# EAGLE schematic untitled (EAGLE 8.6.0)
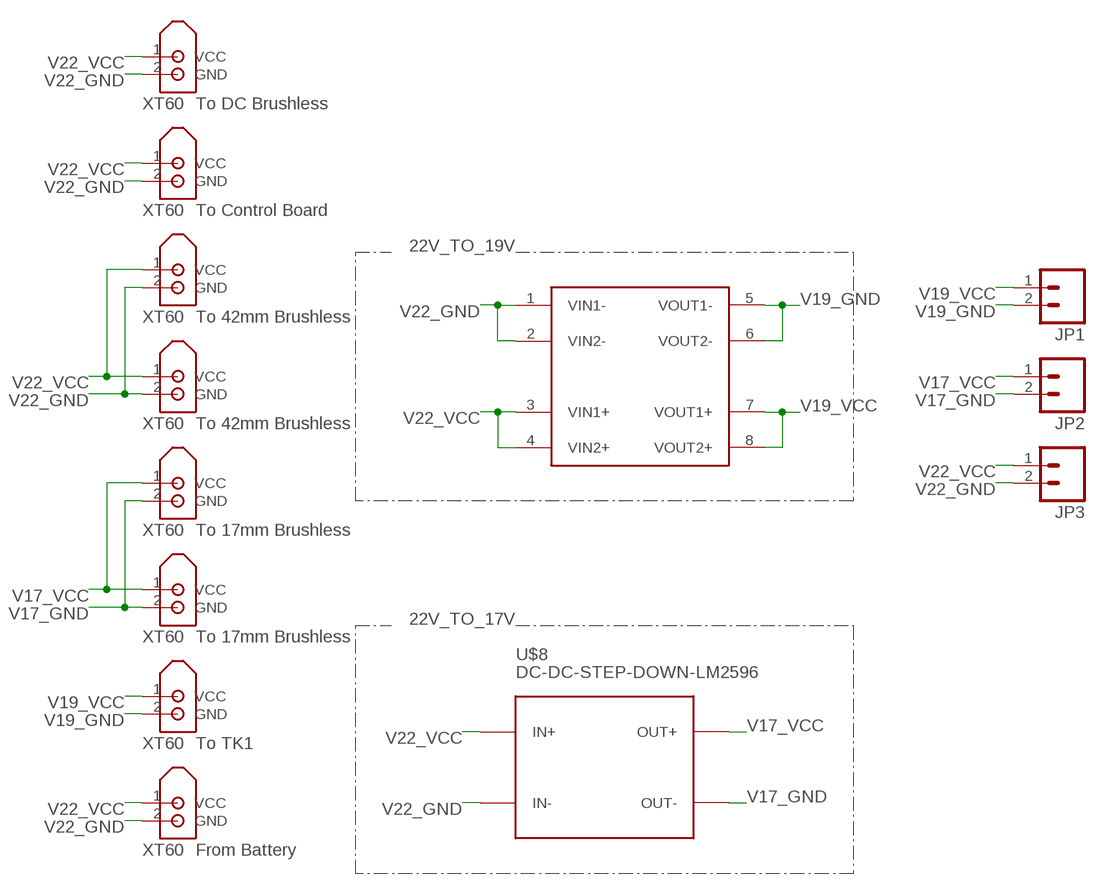
[diagram p0: schematic, sheet 1]

## Parts
JP1  M02JST-PTH-VERT  [JST-2-PTH-VERT]
JP2  M02JST-PTH-VERT  [JST-2-PTH-VERT]
JP3  M02JST-PTH-VERT  [JST-2-PTH-VERT]
U$1  XT60  [XT60]
U$2  XT60  [XT60]
U$3  XT60  [XT60]
U$4  XT60  [XT60]
U$5  XT60  [XT60]
U$6  XT60  [XT60]
U$7  MP1584  [MP1584_AMAZON]
U$8  DC-DC-STEP-DOWN-LM2596  [DC-DC-STEP-DOWN-LM2596]
U$9  XT60  [XT60]
U$10  XT60  [XT60]

## Nets
V17_GND [Voltmeter]: JP2.2 U$3.2(GND) U$4.2(GND) U$8.OUT-
V17_VCC [Voltmeter]: JP2.1 U$3.1(VCC) U$4.1(VCC) U$8.OUT+
V19_GND [Voltmeter]: JP1.2 U$2.2(GND) U$7.5(VOUT1-) U$7.6(VOUT2-)
V19_VCC [Voltmeter]: JP1.1 U$2.1(VCC) U$7.7(VOUT1+) U$7.8(VOUT2+)
V22_GND [Voltmeter]: JP3.2 U$1.2(GND) U$5.2(GND) U$6.2(GND) U$7.1(VIN1-) U$7.2(VIN2-) U$8.IN- U$9.2(GND) U$10.2(GND)
V22_VCC [Voltmeter]: JP3.1 U$1.1(VCC) U$5.1(VCC) U$6.1(VCC) U$7.3(VIN1+) U$7.4(VIN2+) U$8.IN+ U$9.1(VCC) U$10.1(VCC)

## Notes on the sheet
- To DC Brushless
- To Control Board
- 22V_TO_19V
- To 42mm Brushless
- To 42mm Brushless
- To 17mm Brushless
- 22V_TO_17V
- To 17mm Brushless
- To TK1
- From Battery

## Library data of the parts
JP1-JP3 = SparkFun-Connectors:M02: Standard 2-pin 0.1" header. Use with - straight break away headers ( PRT-00116) - right angle break away headers (PRT-00553) - swiss pins (PRT-00743) - machine pins (PRT-00117) - female headers (PRT-00115) Molex polarized connector foot print use with: PRT-08233 with associated crimp pins and housings. 2.54_SCREWTERM for use with PRT-10571. 3.5mm Screw Terminal footprints for PRT-08084 5mm Screw Terminal footprints for use with PRT-08432
U$1-U$6 U$9 U$10 = KevinMade:XT60
U$7 = KevinMade:MP1584
U$8 = diy-modules:DC-DC-STEP-DOWN-LM2596: DC/DC Step-Down Regulator based on LM2596-ADJ chip LM2596 datasheet available here: http://www.ti.com/lit/ds/symlink/lm2596.pdf Click here to find device on ebay.com <http://www.ebay.com/sch/lm2596+power+regulator>

## Net classes
0 default: width 1.2 mm, clearance 1.2 mm
1 Voltmeter: width 0.8 mm, clearance 0.8 mm